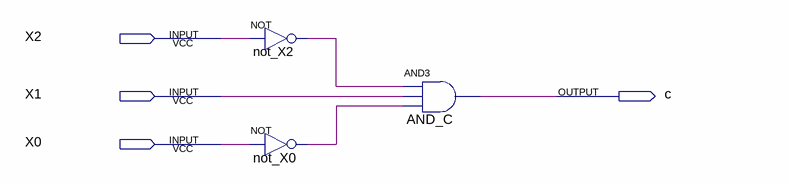
[diagram p0: schematic sheet]
// Quartus schematic dec_segmento_C.bdf as structural Verilog: 3 symbols, 4 pins
module dec_segmento_C (
  input  X2,
  input  X1,
  input  X0,
  output c
);

  wire not_X0_out, not_X2_out;

  not not_X2 (not_X2_out, X2);
  not not_X0 (not_X0_out, X0);
  and AND_C (c, not_X2_out, X1, not_X0_out);
endmodule
